# Altium project Soldering_Iron_Vol3.PrjPcb
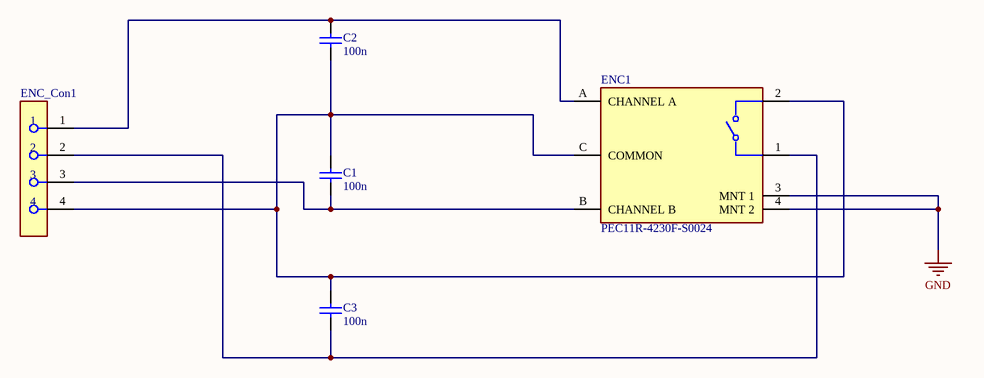
[diagram p0: rotary_enc.SchDoc]
3 sheets, 44 parts. Net scope: global (net labels, ports and power ports of the same name join across sheets).
Board files: Rotary_pcb.PcbDoc, Power_pcb.PcbDoc, Main_pcb.PcbDoc, pcb_full.PcbDoc
Sheets:
  rotary_enc.SchDoc
  power_schem.SchDoc
  Main.SchDoc

## Sheet rotary_enc.SchDoc
size B; SheetNumber: 1; SheetTotal: 3

### Parts
C1  100n  [Capacitor_1206]
C2  100n  [Capacitor_1206]
C3  100n  [Capacitor_1206]
ENC1  PEC11R-4230F-S0024  [Rotary_Encoder_PEC11R-4230F-S0024]
ENC_Con1  (no value)  [Header-Female-JST_4pin]

### Nets
GND: ENC1.3(MNT_1) ENC1.4(MNT_2)
NetC1_1: C1.1 ENC1.B(CHANNEL_B) ENC_Con1.3
NetC1_2: C1.2 C2.1 C3.2 ENC1.2 ENC1.C(COMMON) ENC_Con1.4
NetC2_2: C2.2 ENC1.A(CHANNEL_A) ENC_Con1.1
NetC3_1: C3.1 ENC1.1 ENC_Con1.2

### Library data of the parts
C1-C3 = Capacitor_1206: CAP, Ceramic, 0.1 uF, +/- 10%, 50 V, -55 to 125 degC, 1206 (3216 Metric), RoHS, Tape and Reel; Manufacturer: Kemet; Voltage Rating: 50V; Capacitance: 0.1µF; Product Range: KEMET-CSeries; SVHC: ToBeAdvised; Dielectric Characteristic: X7R; Capacitor Case Style: 1206[3216Metric]; Package Reference: 1206-2; Package Description: 2-Leads SMD, Body 3.2 x 1.6 mm; Packaging: Tape&Reel; Operating Temperature Max: 125degC; Capacitance Tolerance: ±10%; Datasheet URL: https://datasheet.ciiva.com/6125/1725438-6125494.pdf; Manufacturer URL: http://www.kemet.com/; Operating Temperature Min: -55degC; Datasheet Version: Jul-13
ENC1 = Rotary_Encoder_PEC11R-4230F-S0024: ROTARY ENCODER MECHANICAL 24PPR; Detent: Yes; Number of Channels: 2; Output Type: Quadrature; Pulses per Revolution: 24; Hole Diameter: 1.8mm; Package Quantity: 75; REACH SVHC: No SVHC; Width: 12.5mm; Packaging: Bulk; Orientation: Vertical; Mount: Through Hole; Length: 36.5mm; Height: 13.4mm; Series: PEC11R; Min Operating Temperature: -30°C; Built in Switch: Yes; Max Operating Temperature: 70°C; Encoder Type: Mechanical; Termination: PC Pin; RoHS Compliant: Yes
ENC_Con1 = Header-Female-JST_4pin: Contact Resistance: 10mR; Number of Positions: 4; Pitch: 2.54mm; Gender: Female; Connector Type: Receptacle; Max Current Rating: 1A; Color: Black; Contact Material: Copper; Min Operating Temperature: -55°C; Max Operating Temperature: 125°C; Radiation Hardening: No; Termination: Solder; Depth: 2.54mm; Contact Plating: Gold; Orientation: Straight; Housing Color: Black; Width: 2.54mm; RoHS Compliant: Yes; Lead Free: Lead Free; Mount: Through Hole; Series: SS; Length: 10.16mm; Packaging: Bulk; Package Quantity: 1; Housing Material: Polyester; Number of Contacts: 4; Number of Rows: 1

## Sheet power_schem.SchDoc
size B; SheetNumber: 2; SheetTotal: 3
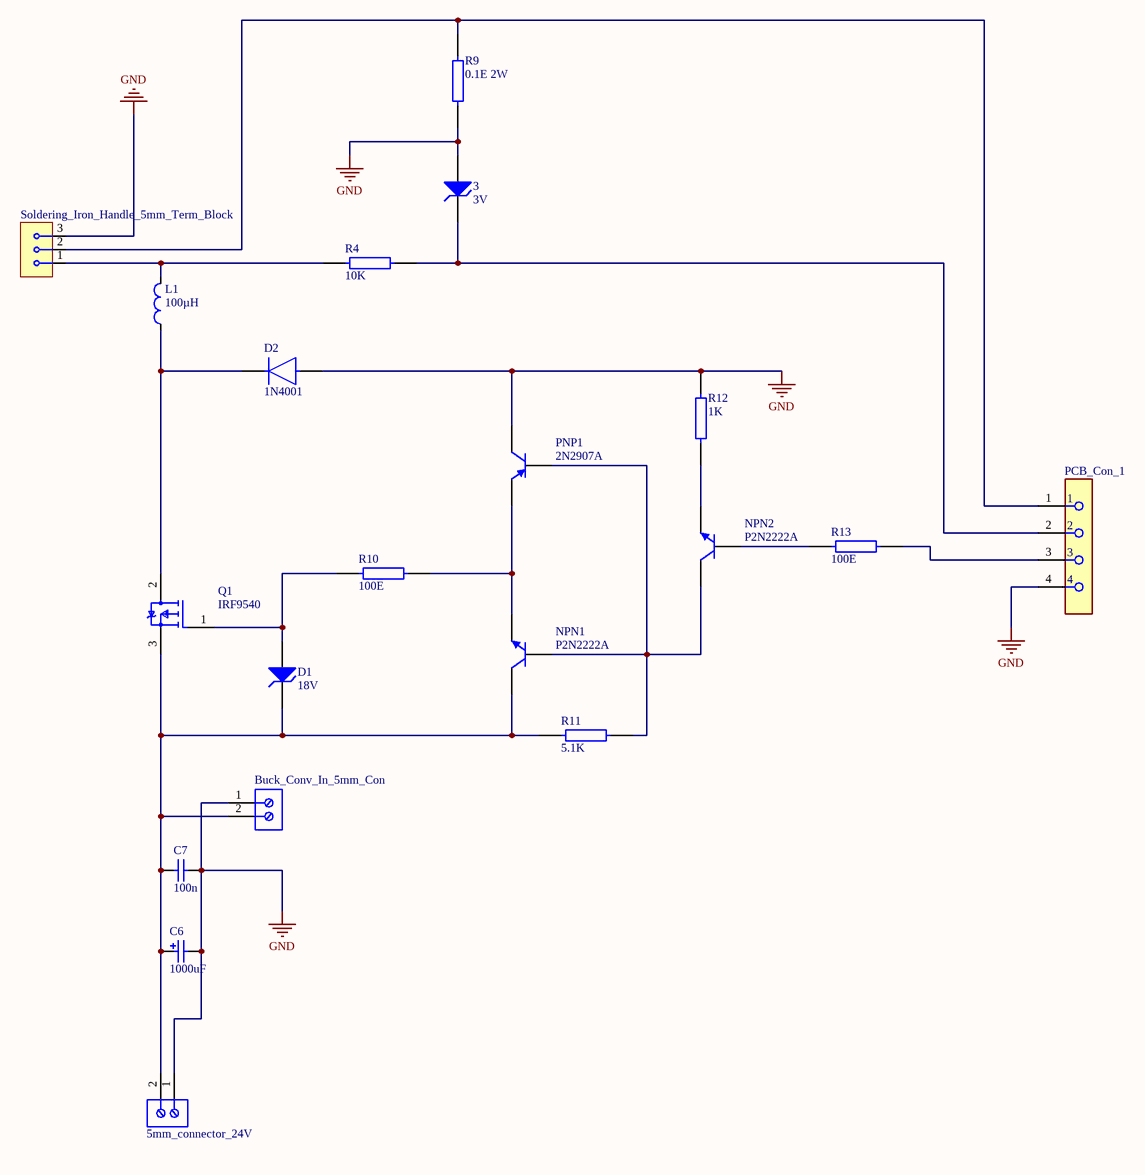
[diagram p1: power_schem.SchDoc]

### Parts
3  3V  [Zener_Diode]
5mm_connector_24V  (no value)  [screw_terminal]
Buck_Conv_In_5mm_Con  (no value)  [screw_terminal]
C6  1000uF  [Capacitor_Polarised]
C7  100n  [Capacitor_Monolitoc]
D1  18V  [Zener_Diode]
D2  1N4001  [Zener_Diode]
L1  100µH  [Coil]
NPN1  P2N2222A  [NPN_Transistor_2N2222A]
NPN2  P2N2222A  [NPN_Transistor_2N2222A]
PCB_Con_1  (no value)  [Header-Female-JST_4pin]
PNP1  2N2907A  [PNP_Transistor_2N2907A]
Q1  IRF9540  [Mosfet_IRF9540NPBF]
R4  10K  [Resistor]
R9  0.1E 2W  [Resistor]
R10  100E  [Resistor]
R11  5.1K  [Resistor]
R12  1K  [Resistor]
R13  100E  [Resistor]
Soldering_Iron_Handle_5mm_Term_Block  (no value)  [3Pin_Connector]

### Nets
GND: 3.2(A) 5mm_connector_24V.1 Buck_Conv_In_5mm_Con.1 C6.2 C7.2 D2.2(A) PCB_Con_1.4 PNP1.3(C) R9.1 R12.2 Soldering_Iron_Handle_5mm_Term_Block.3
Net3_1: 3.1(K) PCB_Con_1.2 R4.2
Net5mm_connector_24V_2: 5mm_connector_24V.2 Buck_Conv_In_5mm_Con.2 C6.1 C7.1 D1.1(K) NPN1.1(C) Q1.3(S) R11.1
NetD1_2: D1.2(A) Q1.1(G) R10.1
NetD2_1: D2.1(C) L1.1 Q1.2(D)
NetL1_2: L1.2 R4.1 Soldering_Iron_Handle_5mm_Term_Block.1
NetNPN1_2: NPN1.2(B) NPN2.1(C) PNP1.2(B) R11.2
NetNPN1_3: NPN1.3(E) PNP1.1(E) R10.2
NetNPN2_2: NPN2.2(B) R13.2
NetNPN2_3: NPN2.3(E) R12.1
NetPCB_Con_1_1: PCB_Con_1.1 R9.2 Soldering_Iron_Handle_5mm_Term_Block.2
NetPCB_Con_1_3: PCB_Con_1.3 R13.1

### Library data of the parts
3 D1 = Zener_Diode: PartNumber: 1N5931BRLG; Manufacturer: On Semiconductor; Packing: Tape and Reel; VZ Typ (V): 18; DatasheetVersion: Rev. 5; PackageVersion: Rev. U, 02/2005; ComponentLink1URL: http://www.onsemi.com/; ComponentLink3URL: http://www.onsemi.cn/pub_link/Collateral/59-10.PDF; RoHS: Pb-Free; ComponentLink3Description: Package Specification; ComponentLink1Description: Manufacturer URL; PackageReference: AXIAL_LEAD-2-59-10; PackageDescription: 2-Pin, Axial Lead, Diameter 2.35 mm; ComponentLink2URL: http://www.onsemi.cn/pub_link/Collateral/1N5913B-D.PDF; ComponentLink2Description: Datasheet; Mounting Technology: Through Hole
5mm_connector_24V Buck_Conv_In_5mm_Con = Screw_Terminal: NexarPartId: 18818288; Plating: Brass, Steel; Current: 10A; Pitch: 3.5052mm; Number of Levels: 1; Number of Contacts: 2; Wire Gauge (Min): 16AWG; Voltage: 300V; Wire Gauge (Max): 24AWG; Stripping Length: -6mm; Number of Pins: 2; Number of Rows: 1; REACH SVHC: Unknown; RoHS: Compliant; Housing Material: Nylon; Termination: Screw; Mount: Through Hole; Contact Plating: Brass, Tin; Number of Positions Per Level: 2; Color: Blue, Green; Width: 7.9mm; Voltage Rating: 300V; Length: 7.4mm; Current Rating: 10A; Wire/Cable Gauge: 24AWG; Packaging: Box; Max Operating Temperature: 105°C; Lead Pitch: 3.5mm; Height: 8.7mm; Contact Material: Brass; Min Operating Temperature: -40°C
C6 = Capacitor_Polarised: Manufacturer: Murata; Packaging type: Bulk; CS: 5mm; Tolerance: 10%; Capacity (elec.): 10nF; Material: Ceramic; Type: radiallead; Industrial packaging: Yes; Nominal voltage: 1000V; Content: 500pc(s); Category: Ceramiccapacitor; Datasheet Version: 06/2016; Package Reference: DEBF33A103ZA2B; Mounting Technology: ThroughHole; Package Description: 2-Pin Through Hole Device, Body 4 x 10 mm, Pitch 5 mm; Datasheet URL: http://psearch.en.murata.com/capacitor/product/DEBF33A103ZA2B.pdf; Manufacturer URL: http://www.murata.com/
C7 = Capacitor_Monolitic: Manufacturer: Murata; Packaging type: Bulk; CS: 5mm; Tolerance: 10%; Capacity (elec.): 10nF; Material: Ceramic; Type: radiallead; Industrial packaging: Yes; Nominal voltage: 1000V; Content: 500pc(s); Category: Ceramiccapacitor; Datasheet Version: 06/2016; Package Reference: DEBF33A103ZA2B; Mounting Technology: ThroughHole; Package Description: 2-Pin Through Hole Device, Body 4 x 10 mm, Pitch 5 mm; Datasheet URL: http://psearch.en.murata.com/capacitor/product/DEBF33A103ZA2B.pdf; Manufacturer URL: http://www.murata.com/
D2 = Diode_UF5408: Capacitance: 36pF; Average Rectified Current: 3A; Recovery Time: 75ns; Max Reverse Current: 10uA; Outside Diameter: 5.3mm; Forward Voltage: 1.7V; Peak Non-Repetitive Surge Current: 150A; Max Repetitive Reverse Voltage (Vrrm): 1kV; Element Configuration: Single; Polarity: Standard; Width: 5.3mm; Mount: Through Hole; Number of Pins: 2; Case/Package: DO-201AD; Series: -; Packaging: Tape and Reel; Max Surge Current: 150A; Length: 9.5mm; Lead Free: Lead Free; Termination: Axial; Reverse Recovery Time-Max: 75ns; Max Operating Temperature: 150°C; Height: 5.3mm; Forward Current: 3A; Radiation Hardening: No; RoHS Compliant: Yes; Min Operating Temperature: -55°C; Output Current: 3A; Reverse Voltage: 1kV; Reverse Recovery Time: 75ns; Max Forward Surge Current (Ifsm): 150A; Package Quantity: 1; Max Reverse Voltage (DC): 1kV
L1 = 100µH_Inductor: Inductance: 100uH; Sample Rate (Hz): 100kHz; Inductance Tolerance: 20%; DC Resistance (DCR): 494mR; Shielding: Shielded; Current Rating: 700mA; Saturation Current: 800mA; Material: Steel; Core Material: Ferrite; Self Resonant Frequency: 5MHz; Termination: SMD/SMT; Packaging: Tape and Reel; Resistor Type: Wirewound; Height: 4.5mm; Number of Pins: 2; Radiation Hardening: No; Height - Seated (Max): 0.177inch; Military Standard: Not; Max DC Current: 700mA; Depth: 6.2mm; Length: 6mm; Weight: 0.027725oz; RoHS Compliant: Yes; Mount: Surface Mount; REACH SVHC: No SVHC; Test Frequency: 100kHz; Tolerance: 20%; Package Quantity: 1000; Width: 6mm; Series: SRN6045; DC Current: 700mA; RMS Current (Irms): 700mA; Case/Package: Nonstandard; Min Operating Temperature: -40°C; Max Operating Temperature: 125°C
NPN1 NPN2 = NPN_Transistor_2N2222A: PartNumber: P2N2222AG; Manufacturer: On Semiconductor; IC Continuous (A): 0.6; Polarity: NPN; Packing: Bulk Box; fT Min (MHz): 300; ComponentLink2Description: Datasheet; ComponentLink1Description: Manufacturer URL; ComponentLink2URL: http://www.onsemi.com/pub_link/Collateral/P2N2222A-D.PDF; ComponentLink3Description: Package Specification; RoHS: TRUE; ComponentLink1URL: http://www.onsemi.com/; Mounting Technology: Through Hole; PackageReference: TO-92-3-29-11_AM_SL; DatasheetVersion: Rev. 7; PackageDescription: 3-Pin Transistor Outline, Body 4.825 x 3.685 mm, Pitch 1.27 mm; PackageVersion: Rev. AM; ComponentLink3URL: http://www.onsemi.cn/pub_link/Collateral/2N6426-D.PDF
PCB_Con_1 = Header-Female-JST_4pin: as ENC_Con1 on sheet rotary_enc; Color: Black; Contact Material: Copper; Min Operating Temperature: -55°C; Max Operating Temperature: 125°C; Radiation Hardening: No; Termination: Solder; Depth: 2.54mm; Contact Plating: Gold; Orientation: Straight; Housing Color: Black; Width: 2.54mm; RoHS Compliant: Yes; Lead Free: Lead Free; Mount: Through Hole; Series: SS; Length: 10.16mm; Packaging: Bulk; Package Quantity: 1; Housing Material: Polyester; Number of Contacts: 4; Number of Rows: 1
PNP1 = PNP_Transistor_2N2907A: Manufacturer: On Semiconductor; PartNumber: MPSA92G; IC Continuous (A): -0.5; Polarity: PNP; fT Min (MHz): 50; Packing: Bulk Box; DatasheetVersion: Rev. 6; ComponentLink2Description: Datasheet; PackageReference: TO-92-3-29-11_AM_SL; RoHS: TRUE; ComponentLink3Description: Package Specification; PackageDescription: 3-Pin Transistor Outline, Body 4.825 x 3.685 mm, Pitch 1.27 mm; ComponentLink3URL: http://www.onsemi.cn/pub_link/Collateral/2N6426-D.PDF; ComponentLink1Description: Manufacturer URL; ComponentLink1URL: http://www.onsemi.com/; Mounting Technology: Through Hole; ComponentLink2URL: http://www.onsemi.cn/pub_link/Collateral/MPSA92-D.PDF; PackageVersion: Rev. AM
Q1 = Mosfet_IRF9540NPBF: Number of Channels: 1; Max Dual Supply Voltage: -100V; Rise Time: 67ns; Max Power Dissipation: 3.1W; Gate to Source Voltage (Vgs): 20V; Drain to Source Resistance: 117mR; Turn-On Delay Time: 13ns; Turn-Off Delay Time: 40ns; Threshold Voltage: 4V; Input Capacitance: 1.45nF; Continuous Drain Current (ID): 23A; Power Dissipation: 110W; Length: 0.42inch; Max Operating Temperature: 150°C; Case/Package: TO-262; Packaging: Rail/Tube; Height: 0.38inch; Drain to Source Voltage (Vdss): -100V; Lead Free: Contains Lead; Rds On Max: 117mR; Width: 0.19inch; Min Operating Temperature: -55°C; RoHS Compliant: Yes; Mount: Through Hole; Number of Pins: 3; Halogen Free: Not Halogen Free; REACH SVHC: No SVHC
R4 R9-R13 = Resistor: NexarPartId: 44386654; Tolerance: 1%; Max Power Dissipation: 250mW; Voltage Rating: 200V; Power Rating: 125mW; Temperature Coefficient: 50ppm/°C; Resistance: 73.2kΩ; Width: 1.65mm; Length: 3.81mm; Schedule B: 8533210090, 8533210090|8533210090|8533210090|8533210090|8533210090; Termination: Axial; Lead Free: Lead Free; Diameter: 1.65mm; Voltage Rating (DC): 200V; Packaging: Cut Tape; Max Operating Temperature: 175°C; Composition: Metal Film; RoHS: Compliant; Mount: Through Hole; Features: Flame Retardant Coating, Moisture Resistant; Number of Terminations: 2; Min Operating Temperature: -55°C; Case/Package: Axial
Soldering_Iron_Handle_5mm_Term_Block = 3Pin_Connector

## Sheet Main.SchDoc
size B; SheetNumber: 3; SheetTotal: 3
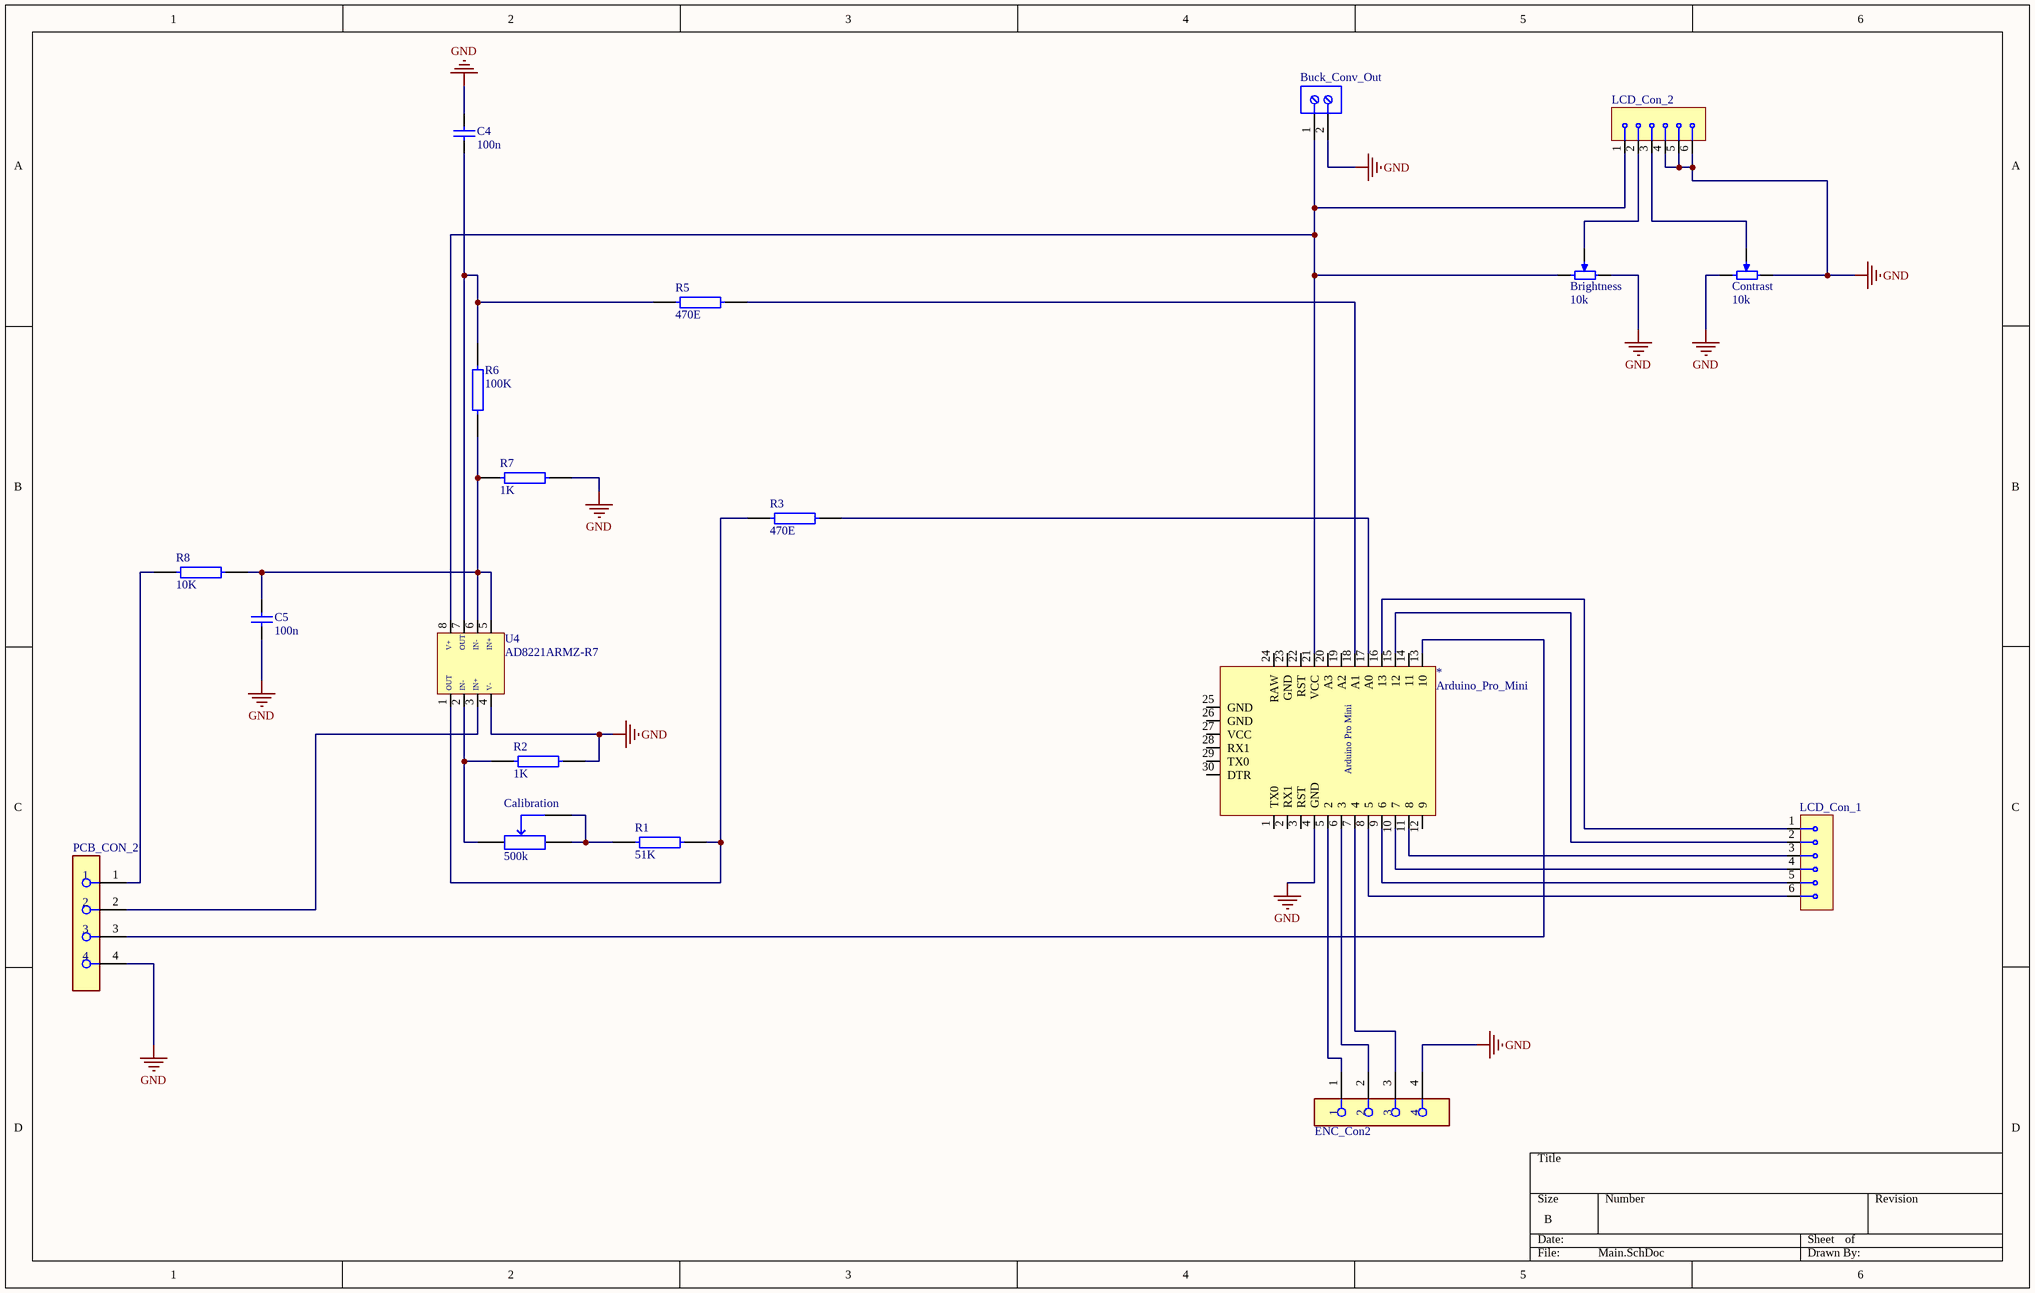
[diagram p2: Main.SchDoc]

### Parts
*  Arduino_Pro_Mini  [Arduino_Mini_Pro]
Brightness  10k  [10k_Trim_Pot]
Buck_Conv_Out  (no value)  [screw_terminal]
C4  100n  [Capacitor_Monolitoc]
C5  100n  [Capacitor_Monolitoc]
Calibration  500k  [500k_Trim_Pot]
Contrast  10k  [10k_Trim_Pot]
ENC_Con2  (no value)  [Header-Female-JST_4pin]
LCD_Con_1  (no value)  [6Pin_Connector]
LCD_Con_2  (no value)  [6Pin_Connector]
PCB_CON_2  (no value)  [Header-Female-JST_4pin]
R1  51K  [Resistor]
R2  1K  [Resistor]
R3  470E  [Resistor]
R5  470E  [Resistor]
R6  100K  [Resistor]
R7  1K  [Resistor]
R8  10K  [Resistor]
U4  AD8221ARMZ-R7  [DIP8_AD822]

### Nets
GND: *.4(GND) Brightness.1(CCW) Buck_Conv_Out.2 C4.2 C5.1 Contrast.1(CCW) Contrast.3(CW) ENC_Con2.4 LCD_Con_2.4 LCD_Con_2.5 LCD_Con_2.6 PCB_CON_2.4 R2.2 R7.2 U4.4
Net*_5: *.5(2) ENC_Con2.1
Net*_6: *.6(3) ENC_Con2.2
Net*_7: *.7(4) ENC_Con2.3
Net*_8: *.8(5) LCD_Con_1.6
Net*_9: *.9(6) LCD_Con_1.5
Net*_10: *.10(7) LCD_Con_1.4
Net*_11: *.11(8) LCD_Con_1.3
Net*_13: *.13(10) PCB_CON_2.3
Net*_15: *.15(12) LCD_Con_1.2
Net*_16: *.16(13) LCD_Con_1.1
Net*_17: *.17(A0) R3.2
Net*_18: *.18(A1) R5.2
Net*_21: *.21(VCC) Brightness.3(CW) Buck_Conv_Out.1 LCD_Con_2.1 U4.8
NetBrightness_2: Brightness.2(S) LCD_Con_2.2
NetC4_1: C4.1 R5.1 R6.2 U4.7
NetC5_2: C5.2 R6.1 R7.1 R8.2 U4.5 U4.6
NetCalibration_1: Calibration.1(CCW) Calibration.2(WIPER) R1.1
NetCalibration_3: Calibration.3(CW) R2.1 U4.2
NetContrast_2: Contrast.2(S) LCD_Con_2.3
NetPCB_CON_2_1: PCB_CON_2.1 R8.1
NetPCB_CON_2_2: PCB_CON_2.2 U4.3
NetR1_2: R1.2 R3.1 U4.1

Not connected (* = marked no-connect by the designer): * 1(TX0) 2(RX1) 3(RST) 12(9) 14(11) 19(A2) 20(A3) 22(RST) 23(GND) 24(RAW) 25(GND) 26(GND) 27(VCC) 28(RX1) 29(TX0) 30(DTR)

### Notes on the sheet
- (in symbol Arduino_Pro_Mini) Arduino Pro Mini
- (in symbol OP_AMP_AD822) V+; OUT; IN-; IN+; V-

### Library data of the parts
Brightness Contrast = 10k_Trim_Pot: Voltage Rating: 220 mV; Power Rating: 1 W; Tolerance: 1%; Resistance: 50 mohm; Case/Package: 1206; Length: 3.2 mm; RoHSCompliant: True; PackageDescription: 3-Pin Through Hole Device, Body 6.6 x 6.99 mm, Pitch 2.54 mm; ComponentLink2Description: Datasheet; REACH SVHC: No SVHC; Mount: Surface Mount; Height: 0.6 mm; Packaging: Tape and Reel; ComponentLink1URL: http://www.bourns.com/; Case Code (Imperial): 0612; Pins: 2; Case Code (Metric): 1632; ComponentLink2URL: http://www.bourns.com/docs/Product-Datasheets/3362.pdf; Min Operating Temperature: -25degC; ComponentLink1Description: Manufacturer URL; PackageReference: 3326P; Max Operating Temperature: 125degC; Width: 1.6 mm; Package Quantity: 5000; DatasheetVersion: May-16
Buck_Conv_Out = Screw_Terminal: as 5mm_connector_24V on sheet power_schem; Number of Pins: 2; Number of Rows: 1; REACH SVHC: Unknown; RoHS: Compliant; Housing Material: Nylon; Termination: Screw; Mount: Through Hole; Contact Plating: Brass, Tin; Number of Positions Per Level: 2; Color: Blue, Green; Width: 7.9mm; Voltage Rating: 300V; Length: 7.4mm; Current Rating: 10A; Wire/Cable Gauge: 24AWG; Packaging: Box; Max Operating Temperature: 105°C; Lead Pitch: 3.5mm; Height: 8.7mm; Contact Material: Brass; Min Operating Temperature: -40°C
C4 C5 = Capacitor_Monolitic: as C7 on sheet power_schem; Category: Ceramiccapacitor; Datasheet Version: 06/2016; Package Reference: DEBF33A103ZA2B; Mounting Technology: ThroughHole; Package Description: 2-Pin Through Hole Device, Body 4 x 10 mm, Pitch 5 mm; Datasheet URL: http://psearch.en.murata.com/capacitor/product/DEBF33A103ZA2B.pdf; Manufacturer URL: http://www.murata.com/
Calibration = 500k_Trim_Pot: TRIMMER 500K OHM 0.5W PC PIN TOP; Manufacturer: Bourns; Manufacturer Part Number: 3296W-1-504LF; Resistance: 500kΩ; Temperature Coefficient: 100ppm/°C; Value: 500kΩ; Tolerance: 10%; Voltage Rating: 300V; Standoff Height: 0.38mm; ComponentLink2Description: Datasheet; Package: 3296W; Series: Trimpot 3296-Sealed; Lead Free: Yes; Octopart: https://octopart.com/3296w-1-504lf-bourns-143884; Device Class L2: Resistors; Automotive: No; RoHS: TRUE; Temperature Range High: +125°C; Height: 12.05mm; Power Rating: 0.5W; Temperature Range Low: -55°C; ComponentLink2URL: https://www.bourns.com/docs/Product-Datasheets/3296.pdf; Device Class L1: Passive Components; Device Class L3: Variable Resistors and Potentiometers; Category: Res; Temperature: -55°C to +125°C; Digikey Description: TRIMMER 500K OHM 0.5W PC PIN TOP; Mouser Description: Trimmer; Cermet; Rest 500 Kilohms; PCB; 25 Turns; Pwr-Rtg 0.5W
ENC_Con2 PCB_CON_2 = Header-Female-JST_4pin: as ENC_Con1 on sheet rotary_enc; Color: Black; Contact Material: Copper; Min Operating Temperature: -55°C; Max Operating Temperature: 125°C; Radiation Hardening: No; Termination: Solder; Depth: 2.54mm; Contact Plating: Gold; Orientation: Straight; Housing Color: Black; Width: 2.54mm; RoHS Compliant: Yes; Lead Free: Lead Free; Mount: Through Hole; Series: SS; Length: 10.16mm; Packaging: Bulk; Package Quantity: 1; Housing Material: Polyester; Number of Contacts: 4; Number of Rows: 1
LCD_Con_1 LCD_Con_2 = 6Pin_Connector
R1-R3 R5-R8 = Resistor: as R4 on sheet power_schem; Width: 1.65mm; Length: 3.81mm; Schedule B: 8533210090, 8533210090|8533210090|8533210090|8533210090|8533210090; Termination: Axial; Lead Free: Lead Free; Diameter: 1.65mm; Voltage Rating (DC): 200V; Packaging: Cut Tape; Max Operating Temperature: 175°C; Composition: Metal Film; RoHS: Compliant; Mount: Through Hole; Features: Flame Retardant Coating, Moisture Resistant; Number of Terminations: 2; Min Operating Temperature: -55°C; Case/Package: Axial
U4 = OP_AMP_AD822: Manufacturer: Analog Devices; Packing: Tape and Reel; -3dB Bandwidth@G: 1=825 kHz; VIO: 60 uV Max.; Quiescent Current: 0.9 mA Typ.; Slew Rate@G: 1=2 V/us Typ.; PartNumber: AD8221ARMZ-R7; ComponentLink3Description: Package Specification; PackageVersion: Aug-05; Temperature Range: -40 to 125 degC; RoHS: TRUE; ComponentLink3URL: http://www.analog.com/static/imported-files/packages/PKG_PDF/MSOP(RM)/RM_8.pdf; PackageDescription: 8-Pin Mini Small Outline Package, Body 3 x 3 mm, Pitch 0.65 mm; ComponentLink1URL: http://www.analog.com/en/index.html; ComponentLink2URL: http://www.analog.com/static/imported-files/data_sheets/AD8221.pdf; ComponentLink2Description: Datasheet; ComponentLink1Description: Manufacturer URL; DatasheetVersion: Rev. C; Mounting Technology: Surface Mount

## Nets that join several sheets
GND: rotary_enc (ENC1.3 ENC1.4), power_schem (11 pins), Main (15 pins)